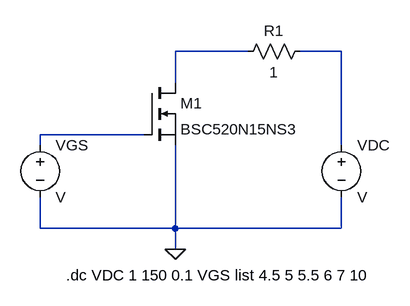
[diagram p0: schematic output characteristics.asc]
output characteristics.asc, the LTspice schematic file:
Version 4
SHEET 1 880 680
WIRE 288 64 176 64
WIRE 432 64 368 64
WIRE 176 112 176 64
WIRE 128 192 -32 192
WIRE -32 208 -32 192
WIRE 432 208 432 64
WIRE -32 336 -32 288
WIRE 176 336 176 208
WIRE 176 336 -32 336
WIRE 432 336 432 288
WIRE 432 336 176 336
WIRE 176 368 176 336
FLAG 176 368 0
SYMBOL nmos 128 112 R0
SYMATTR InstName M1
SYMATTR Value BSC520N15NS3
SYMBOL voltage -32 192 R0
SYMATTR InstName VGS
SYMBOL voltage 432 192 R0
SYMATTR InstName VDC
SYMBOL res 384 48 R90
WINDOW 0 0 56 VBottom 2
WINDOW 3 32 56 VTop 2
SYMATTR InstName R1
SYMATTR Value 1
TEXT 8 408 Left 2 !.dc VDC 1 150 0.1 VGS list 4.5 5 5.5 6 7 10

The netlist it stands for:
* output characteristics.asc
M1 N001 N003 0 0 BSC520N15NS3
VGS N003 0 V
VDC N002 0 V
R1 N002 N001 1
.model NMOS NMOS
.model PMOS PMOS
.lib standard.mos
.dc VDC 1 150 0.1 VGS list 4.5 5 5.5 6 7 10
.backanno
.end

* Results of the author's LTspice run, read from the files saved beside the schematic
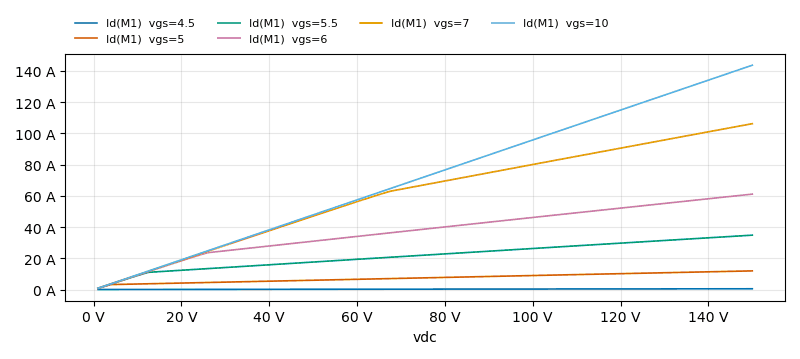
[diagram p1: DC transfer characteristic of output characteristics.asc, plotted from the saved traces]
* DC transfer characteristic, 6 runs:
*   Id(M1) [vgs=4.5]: 160.3 mA at vdc=1 V, 626.5 mA at vdc=150 V, min 160.3 mA, max 626.5 mA
*   Id(M1) [vgs=5]: 884 mA at vdc=1 V, 12.07 A at vdc=150 V, min 884 mA, max 12.07 A
*   Id(M1) [vgs=5.5]: 922.6 mA at vdc=1 V, 34.92 A at vdc=150 V, min 922.6 mA, max 34.92 A
*   Id(M1) [vgs=6]: 936.6 mA at vdc=1 V, 61.17 A at vdc=150 V, min 936.6 mA, max 61.17 A
*   Id(M1) [vgs=7]: 948.5 mA at vdc=1 V, 106.2 A at vdc=150 V, min 948.5 mA, max 106.2 A
*   Id(M1) [vgs=10]: 958.8 mA at vdc=1 V, 143.6 A at vdc=150 V, min 958.8 mA, max 143.6 A